# EAGLE design NerfPWM V1.1 (EAGLE 6.3)
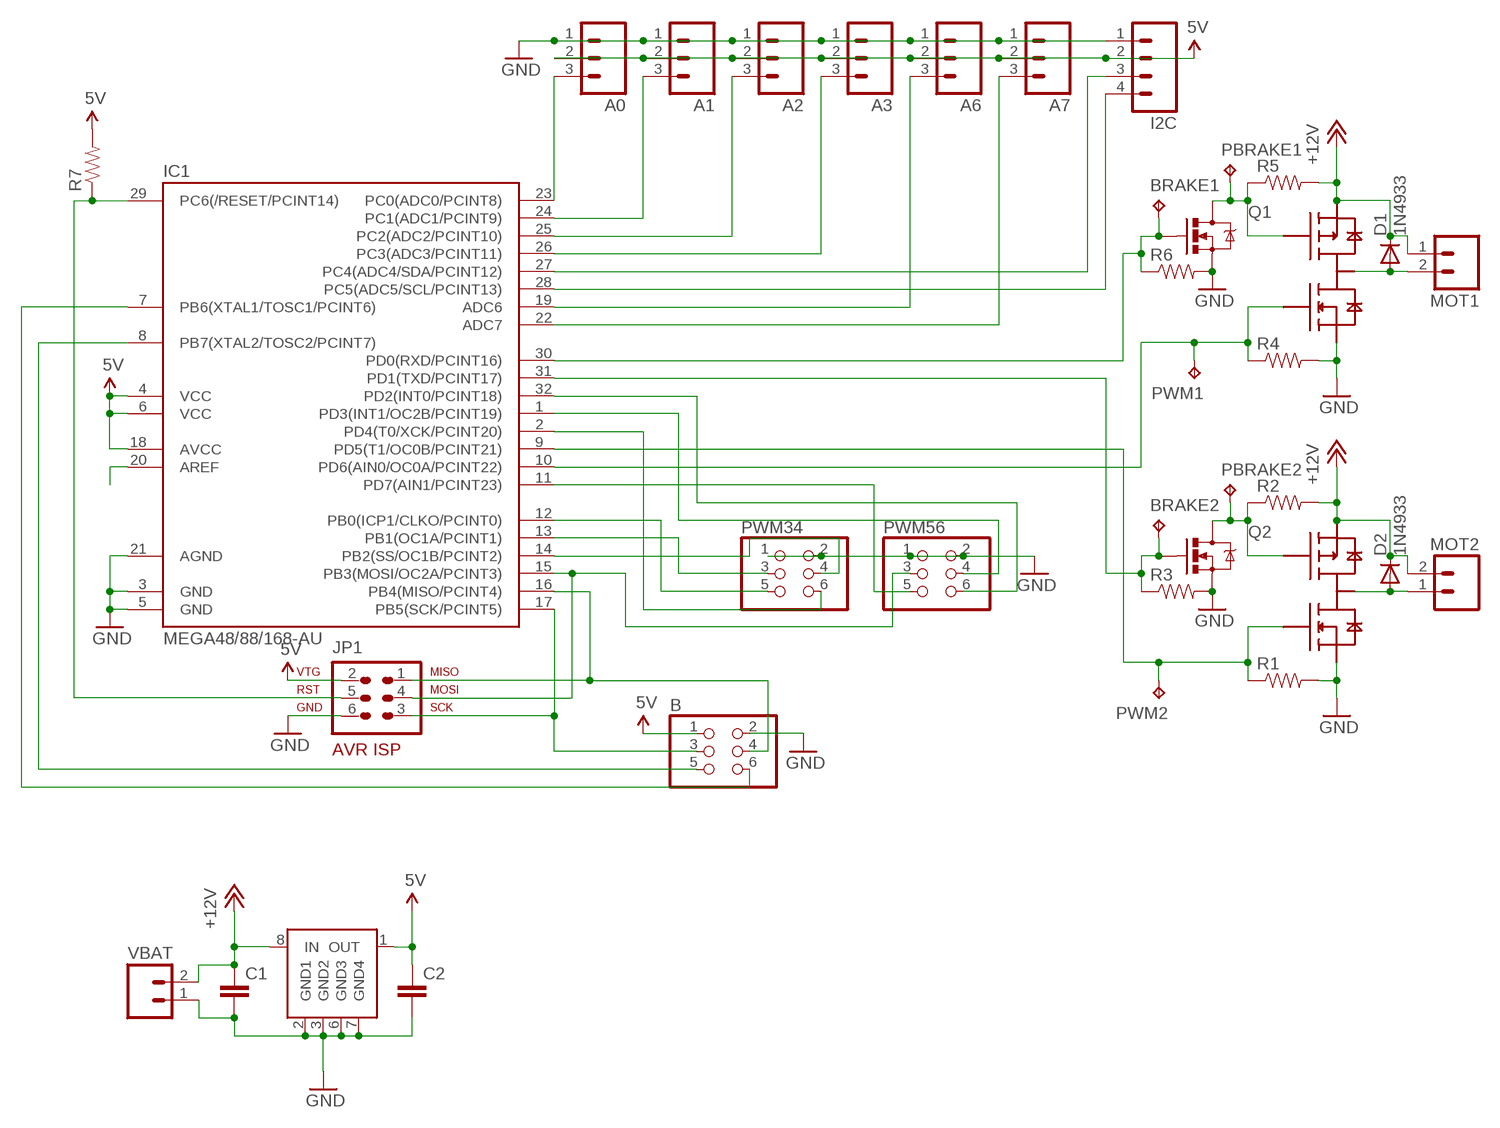
[diagram p0: schematic, sheet 1]

## Parts
A0  M03PTH  [1X03]
A1  M03PTH  [1X03]
A2  M03PTH  [1X03]
A3  M03PTH  [1X03]
A6  M03PTH  [1X03]
A7  M03PTH  [1X03]
B  PINHD-2X3  [2X03]
BRAKE1  TPTP10R  [TP10R]
BRAKE2  TPTP10R  [TP10R]
C1  CAP1206  [1206]
C2  CAP1206  [1206]
D1  1N4933  [DO41-10]
D2  1N4933  [DO41-10]
I2C  M04PTH  [1X04]
IC1  MEGA48/88/168-AU  [TQFP32-08]
JP1  AVR-ISP-6  [AVR-ISP-6]
MOT1  M023.5MM_LOCK  [SCREWTERMINAL-3.5MM-2_LOCK]
MOT2  M023.5MM_LOCK  [SCREWTERMINAL-3.5MM-2_LOCK]
PBRAKE1  TPTP10R  [TP10R]
PBRAKE2  TPTP10R  [TP10R]
PWM1  TPTP10R  [TP10R]
PWM2  TPTP10R  [TP10R]
PWM34  PINHD-2X3  [2X03]
PWM56  PINHD-2X3  [2X03]
Q1  MOSFET-NCHANNELSMD  [SOT23-3]
Q2  MOSFET-NCHANNELSMD  [SOT23-3]
R1  RESISTOR  [0805]
R2  RESISTOR  [0805]
R3  RESISTOR  [0805]
R4  RESISTOR  [0805]
R5  RESISTOR  [0805]
R6  RESISTOR  [0805]
R7  RESISTOR  [0805]
U$3  MC78L00AD  [SOIC8]
U$4  SI4501BDY  [SOIC8]
U$5  SI4501BDY  [SOIC8]
VBAT  M023.5MM_LOCK  [SCREWTERMINAL-3.5MM-2_LOCK]

## Nets
5V [5V]: A0.2 A1.2 A2.2 A3.2 A6.2 A7.2 B.1 C2.1 I2C.2 IC1.4(VCC) IC1.6(VCC) IC1.18(AVCC) JP1.2 R7.2 U$3.1(OUT)
+12V [12V]: C1.1 D1.C D2.C MOT1.1 MOT2.2 R2.2 R5.2 U$3.8(IN) U$4.3(S2) U$5.3(S2) VBAT.2
A1: A1.3 IC1.24(PC1(ADC1/PCINT9))
A2: A2.3 IC1.25(PC2(ADC2/PCINT10))
A3: A3.3 IC1.26(PC3(ADC3/PCINT11))
A6: A6.3 IC1.19(ADC6)
A7: A7.3 IC1.22(ADC7)
A): A0.3 IC1.23(PC0(ADC0/PCINT8))
B4: B.4 IC1.16(PB4(MISO/PCINT4)) JP1.1
B5: B.3 IC1.17(PB5(SCK/PCINT5)) JP1.3
B6: B.6 IC1.7(PB6(XTAL1/TOSC1/PCINT6))
B7: B.5 IC1.8(PB7(XTAL2/TOSC2/PCINT7))
BRAKE1: BRAKE1.TP IC1.30(PD0(RXD/PCINT16)) Q1.1(G) R6.1
BRAKE2: BRAKE2.TP IC1.31(PD1(TXD/PCINT17)) Q2.1(G) R3.1
BRAKE3: IC1.12(PB0(ICP1/CLKO/PCINT0)) PWM34.5
BRAKE4: IC1.2(PD4(T0/XCK/PCINT20)) PWM34.6
BRAKE5: IC1.11(PD7(AIN1/PCINT23)) PWM56.5
BRAKE6: IC1.32(PD2(INT0/PCINT18)) PWM56.6
GND [GND]: A0.1 A1.1 A2.1 A3.1 A6.1 A7.1 B.2 C1.2 C2.2 I2C.1 IC1.3(GND) IC1.5(GND) IC1.21(AGND) JP1.6 PWM34.1 PWM34.2 PWM56.1 PWM56.2 Q1.2(S) Q2.2(S) R1.2 R3.2 R4.2 R6.2 U$3.2(GND1) U$3.3(GND2) U$3.6(GND3) U$3.7(GND4) U$4.1(S1) U$5.1(S1) VBAT.1
N$1: IC1.20(AREF)
N$2: PBRAKE2.TP Q2.3(D) R2.1 U$5.4(G2)
N$3: PBRAKE1.TP Q1.3(D) R5.1 U$4.4(G2)
PWM1: IC1.10(PD6(AIN0/OC0A/PCINT22)) PWM1.TP R4.1 U$4.2(G1)
PWM2: IC1.9(PD5(T1/OC0B/PCINT21)) PWM2.TP R1.1 U$5.2(G1)
PWM3: IC1.13(PB1(OC1A/PCINT1)) PWM34.3
PWM4: IC1.14(PB2(SS/OC1B/PCINT2)) PWM34.4
PWM5: IC1.15(PB3(MOSI/OC2A/PCINT3)) JP1.4 PWM56.3
PWM6: IC1.1(PD3(INT1/OC2B/PCINT19)) PWM56.4
RESET: IC1.29(PC6(/RESET/PCINT14)) JP1.5 R7.1
SCL: I2C.4 IC1.28(PC5(ADC5/SCL/PCINT13))
SDA: I2C.3 IC1.27(PC4(ADC4/SDA/PCINT12))
VMOT1 [MOTOR]: D1.A MOT1.2 U$4.5(D) U$4.6(D) U$4.7(D) U$4.8(D)
VMOT2 [MOTOR]: D2.A MOT2.1 U$5.5(D) U$5.6(D) U$5.7(D) U$5.8(D)

## Library data of the parts
A0 A1-A3 A6 A7 = SparkFun:M03: Header 3 Standard 3-pin 0.1" header. Use with straight break away headers (SKU : PRT-00116), right angle break away headers (PRT-00553), swiss pins (PRT-00743), machine pins (PRT-00117), and female headers (PRT-00115). Molex polarized connector foot print use with SKU : PRT-08232 with associated crimp pins and housings.
B PWM34 PWM56 = pinhead:PINHD-2X3: PIN HEADER
BRAKE1 BRAKE2 PBRAKE1 PBRAKE2 PWM1 PWM2 = testpad:TP: Test pad
C1 C2 = SparkFun:CAP: Capacitor Standard 0603 ceramic capacitor, and 0.1" leaded capacitor.
D1 D2 = diode:1N4933: DIODE fast recovery rectifier, 1A
I2C = SparkFun:M04: Header 4 Standard 4-pin 0.1" header. Use with straight break away headers (SKU : PRT-00116), right angle break away headers (PRT-00553), swiss pins (PRT-00743), machine pins (PRT-00117), and female headers (PRT-00115). Molex polarized connector foot print use with SKU : PRT-08231 with associated crimp pins and housings.
IC1 = avr-4:MEGA48/88/168
JP1 = custom:AVR-ISP-6: AVR ISP-6 Serial Programming Header
MOT1 MOT2 VBAT = SparkFun:M02: Header 2 Standard 2-pin 0.1" header. Use with straight break away headers (SKU : PRT-00116), right angle break away headers (PRT-00553), swiss pins (PRT-00743), machine pins (PRT-00117), and female headers (PRT-00115). Molex polarized connector foot print use with SKU : PRT-08233 with associated crimp pins and housings.
Q1 Q2 = SparkFun:MOSFET-NCHANNEL
R1-R7 = SparkFun:RESISTOR: Resistor Basic schematic elements and footprints for 0603, 1206, and PTH 1/10th watt (small) resistors.
U$3 = custom:MC78L00A
U$4 U$5 = custom:SI4501BDY

## Net classes
0 default: width 0.152 mm, drill 0.33 mm, clearance 0.152 mm
1 12V: width 0.61 mm, drill 0.508 mm, clearance 0.305 mm to class 0, clearance 0.305 mm
2 5V: width 0.305 mm, drill 0.33 mm, clearance 0.152 mm to class 0, clearance 0.305 mm to class 1, clearance 0.305 mm
3 MOTOR: width 0.61 mm, drill 0.508 mm, clearance 0.305 mm to class 0, clearance 0.61 mm to class 1, clearance 0.305 mm to class 2, clearance 0.152 mm
4 GND: width 0.305 mm, drill 0.33 mm, clearance 0.152 mm to class 0, clearance 0.61 mm to class 1, clearance 0.152 mm to class 2, clearance 0.61 mm to class 3, clearance 0.152 mm

## Board
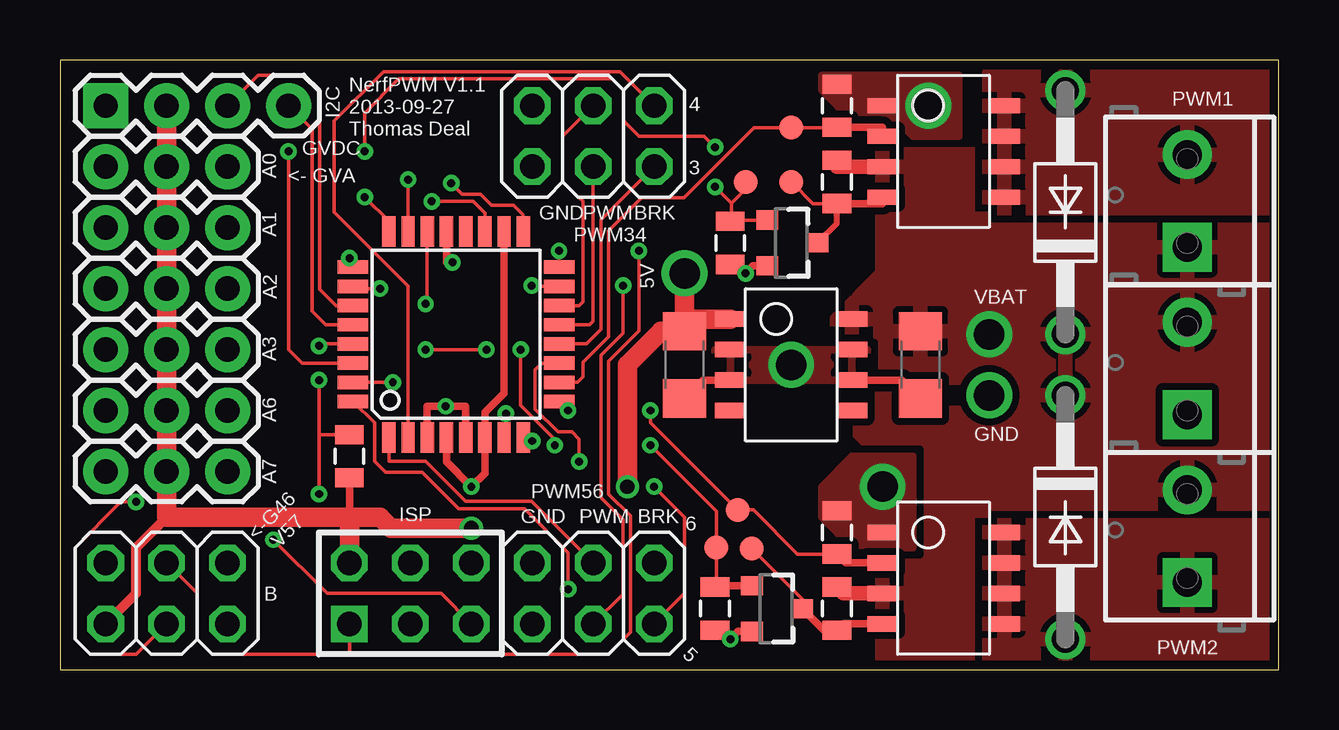
[diagram p1: board, top side]
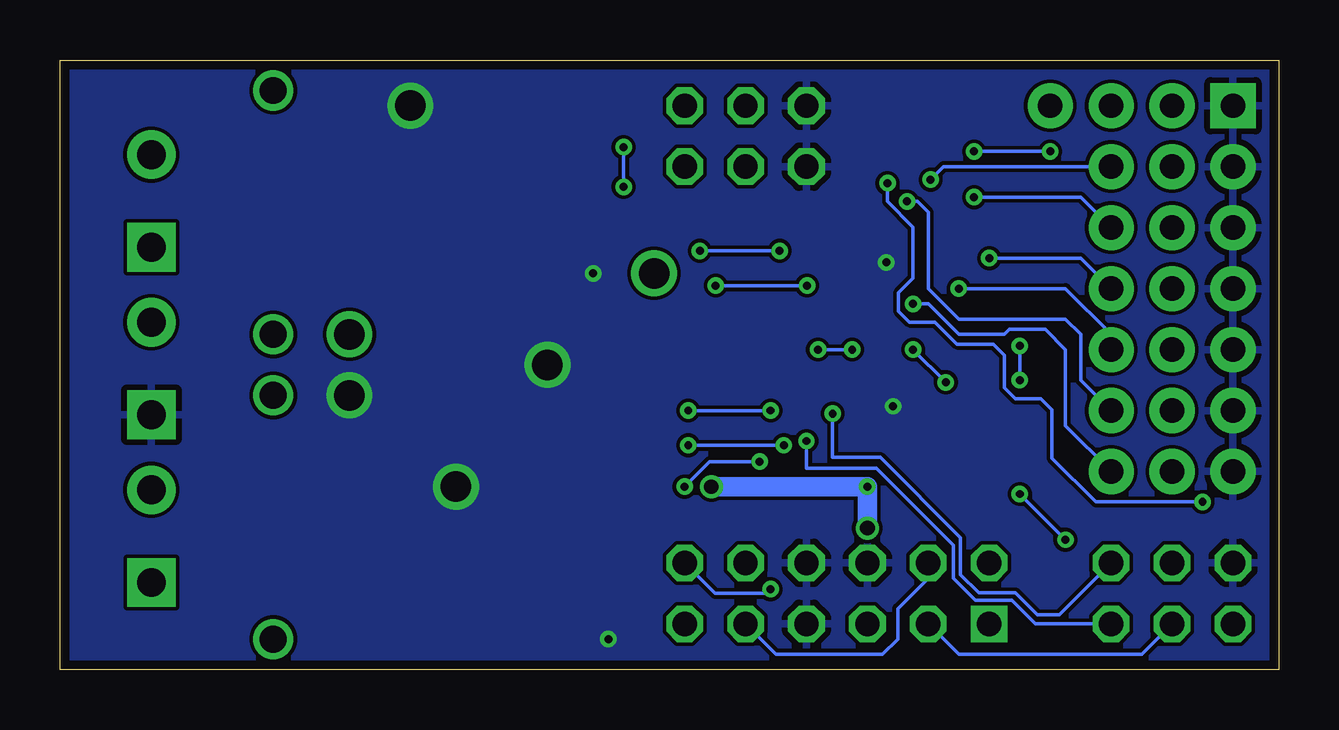
[diagram p2: board, bottom side, seen from below]

Size 50.8 x 25.4 mm. Coordinates in mm from the lower left corner, seen from the top.
Outline: 0,0 50.8,0 50.8,25.4 0,25.4 0,0
Copper layers (1*16): Top 0.0356mm / dielectric 1.5011mm / Bottom 0.0356mm
Design rules "LaenPCBOrder *": minimum track width 6mil, minimum drill 13mil, track to track 6mil, track to pad 6mil, pad to pad 6mil, via to via 6mil, smd to smd 6mil, copper to edge 15mil, drill to drill 6mil, minimum pad ring 7mil, minimum via ring 7mil, stop-mask expansion 4mil, vias tented up to drill 24mil, thermal gap 10mil

### Footprints (pad centres in the part's own frame; a part is rotated, then mirrored left to right if it is on the bottom)
1X03 = drill 1.016 pad 1.88: 1 0,0; 2 2.54,0; 3 5.08,0
2X03 = drill 1.016 octagon: 1 -2.54,-1.27; 2 -2.54,1.27; 3 0,-1.27; 4 0,1.27; 5 2.54,-1.27; 6 2.54,1.27
TP10R = smd 1 x 1: TP 0,0
1206 = smd 1.6 x 1.8: 1 -1.4,0; 2 1.4,0
DO41-10 = drill 1.118: A 5.08,0; C -5.08,0
1X04 = drill 1.016 pad 1.88 square: 1 0,0 | drill 1.016 pad 1.88: 2 2.54,0; 3 5.08,0; 4 7.62,0
TQFP32-08 = smd 1.27 x 0.559: 1 -4.293,2.8; 2 -4.293,2; 3 -4.293,1.2; 4 -4.293,0.4; 5 -4.293,-0.4; 6 -4.293,-1.2; 7 -4.293,-2; 8 -4.293,-2.8; 17 4.293,-2.8; 18 4.293,-2; 19 4.293,-1.2; 20 4.293,-0.4; 21 4.293,0.4; 22 4.293,1.2; 23 4.293,2; 24 4.293,2.8 | smd 0.559 x 1.27: 9 -2.8,-4.293; 10 -2,-4.293; 11 -1.2,-4.293; 12 -0.4,-4.293; 13 0.4,-4.293; 14 1.2,-4.293; 15 2,-4.293; 16 2.8,-4.293; 25 2.8,4.293; 26 2,4.293; 27 1.2,4.293; 28 0.4,4.293; 29 -0.4,4.293; 30 -1.2,4.293; 31 -2,4.293; 32 -2.8,4.293
AVR-ISP-6 = drill 1.016 square: 1 -2.54,-1.27 | drill 1.016 octagon: 2 -2.54,1.27; 3 0,-1.27; 4 0,1.27; 5 2.54,-1.27; 6 2.54,1.27
SCREWTERMINAL-3.5MM-2_LOCK = drill 1.2 pad 2.032 square: 1 -0.178,0 | drill 1.2 pad 2.032: 2 3.678,0
SOT23-3 = smd 0.8 x 0.9: 1 -0.95,-1; 2 0.95,-1; 3 0,1.1
0805 = smd 0.8 x 1.2: 1 -0.9,0; 2 0.9,0
SOIC8 = smd 0.635 x 1.27: 1 -1.905,-2.54; 2 -0.635,-2.54; 3 0.635,-2.54; 4 1.905,-2.54; 5 1.905,2.54; 6 0.635,2.54; 7 -0.635,2.54; 8 -1.905,2.54

### Placement (x,y rotation side)
A0  1.91,20.95 0 top
A1  1.91,18.41 0 top
A2  1.91,15.88 0 top
A3  1.91,13.34 0 top
A6  1.91,10.79 0 top
A7  1.91,8.26 0 top
B  4.45,3.17 0 top
BRAKE1  28.57,20.32 0 top
BRAKE2  27.36,5.08 0 top
C1  35.86,12.7 270 top
C2  26.04,12.7 270 top
D1  41.91,19.05 90 top
D2  41.91,6.35 270 top
I2C  1.91,23.5 0 top
IC1  16.51,13.97 90 top
JP1  14.61,3.17 0 top
MOT1  46.99,17.78 90 top
MOT2  46.99,3.81 90 top
PBRAKE1  30.48,20.32 0 top
PBRAKE2  28.83,5.05 0 top
PWM1  30.48,22.58 0 top
PWM2  28.24,6.65 0 top
PWM34  22.23,22.23 0 top
PWM56  22.23,3.17 0 top
Q1  30.48,17.78 270 top
Q2  29.84,2.54 270 top
R1  32.38,5.71 90 top
R2  32.38,2.54 90 top
R3  27.3,2.54 270 top
R4  32.38,23.5 90 top
R5  32.38,20.32 90 top
R6  27.94,17.78 270 top
R7  12.06,8.89 270 top
U$3  30.48,12.7 270 top
U$4  36.83,21.59 270 top
U$5  36.83,3.81 270 top
VBAT  46.99,10.79 90 top

### Tracks (layer width: path | path; a pad name or v marks a point on that pad's centre or on a via)
5V  (via drill 0.33, 0.6, 0.61, 1.27)
  Top 0.305: IC1.18 18.51,11.53 17.71,10.72 IC1.6 17.71,8.19 v17.14,7.62 16.11,8.65 IC1.4 | R7.2 12.06,6.35
  Top 0.406: B.1 3.17,3.17 3.17,5.08 4.45,6.35
  Top 0.813: I2C.2 A0.2 A1.2 A2.2 A3.2 A6.2 A7.2 4.45,6.35 12.06,6.35 | 12.06,6.35 13.34,6.35 13.79,5.89 v17.14,5.89 | v23.65,7.62 23.65,12.7 25.05,14.1 C2.1 | C2.1 26.54,14.61 U$3.1 | v26.04,16.51 C2.1 | 12.06,6.35 JP1.2
  Bottom 0.813: v17.14,5.89 v17.14,7.62 v23.65,7.62
+12V  (via drill 1.27)
  Top 0.61: U$4.3 32.38,20.95 R5.2 | U$5.3 32.65,3.17 R2.2
  other vias: 38.73,13.97
  pour Top (rank 2): 34.29,25.4 50.8,25.4 50.8,0 34.29,0 34.29,8.89 32.38,10.79 32.38,14.61 34.29,16.51
A1  (via drill 0.33)
  Top 0.152: v12.7,19.68 13.71,18.68 IC1.24
  Bottom 0.152: A1.3 8.26,19.68 v12.7,19.68
A2  (via drill 0.33)
  Top 0.152: v12.06,17.14 12.22,16.99 IC1.25
  Bottom 0.152: A2.3 8.26,17.14 v12.06,17.14
A3  (via drill 0.33)
  Top 0.152: IC1.26 12.31,15.88 v13.34,15.88
  Bottom 0.152: v13.34,15.88 8.89,15.88 6.99,13.97 A3.3
A6  (via drill 0.33)
  Top 0.152: v15.49,19.51 17.22,19.51 17.71,19.02 IC1.19
  Bottom 0.152: A6.3 8.26,12.06 8.26,13.97 8.89,14.61 13.34,14.61 14.61,15.88 14.61,19.05 15.06,19.51 v15.49,19.51
A7  (via drill 0.33)
  Top 0.152: v15.24,15.24 15.31,15.31 IC1.22
  Bottom 0.152: A7.3 8.89,10.16 8.89,13.34 9.73,14.17 11.23,14.17 11.43,13.97 13.34,13.97 14.61,15.24 v15.24,15.24
A)  (via drill 0.33)
  Top 0.152: v14.51,20.41 IC1.23
  Bottom 0.152: A0.3 13.97,20.95 v14.51,20.41
B4  (via drill 0.33)
  Top 0.152: B.4 5.71,3.17 5.71,1.27 6.35,0.64 12.06,0.64 | 12.06,0.64 22.86,0.64 23.77,1.55 23.77,6.4 22.86,7.32 22.86,12.85 24.13,14.12 v24.13,17.45 | v20.8,17.45 IC1.16 | JP1.1 12.06,0.64
  Bottom 0.152: v24.13,17.45 v20.8,17.45
B5  (via drill 0.33)
  Top 0.152: IC1.17 19.31,18.94 18.9,19.36 17.98,19.36 17.53,19.81 16.76,19.81 v16.31,20.27 | v3.17,6.99 2.54,6.99 0.64,5.08 0.64,1.27 1.27,0.64 3.17,0.64 B.3
  Bottom 0.152: B.3 5.71,0.64 13.34,0.64 JP1.3 | v16.31,20.27 16.31,19.51 15.24,18.44 15.24,16.31 15.85,15.7 15.85,14.94 15.39,14.48 14.33,14.48 13.41,13.56 11.89,13.56 11.43,13.11 11.43,11.73 10.97,11.28 9.91,11.28 9.45,10.82 9.45,8.81 7.62,6.99 v3.17,6.99
B6  (via drill 0.33)
  Top 0.152: IC1.7 18.59,9.76 v18.59,10.67
  Bottom 0.152: v18.59,10.67 18.59,8.84 16.61,8.84 13.26,5.49 13.26,3.96 12.5,3.2 10.97,3.2 10.06,2.29 9.14,2.29 B.6
B7  (via drill 0.33)
  Top 0.152: IC1.8 19.31,9.53 v19.68,9.53
  Bottom 0.152: v19.68,9.53 19.68,8.38 16.76,8.38 13.56,5.18 13.56,3.81 12.65,2.9 11.12,2.9 10.13,1.91 B.5
BRAKE1  (via drill 0.33)
  Top 0.152: v9.53,21.59 9.53,13.34 10.09,12.77 IC1.30 | v12.7,21.59 12.7,23.19 14.12,24.61 23.01,24.61 23.5,24.13 23.5,22.86 24.13,22.23 26.85,22.23 v27.3,21.77 | Q1.1 27.99,18.73 | 27.99,18.73 R6.1 | 27.99,18.73 27.99,19.43 | 27.99,19.43 v27.3,20.12 | 27.99,19.43 28.57,20.02 BRAKE1.TP
  Bottom 0.152: v12.7,21.59 v9.53,21.59 | v27.3,21.77 v27.3,20.12
BRAKE2  (via drill 0.33)
  Top 0.152: 27.36,3.49 BRAKE2.TP 27.36,6.6 v24.61,9.35 | v19.2,13.34 19.2,11.02 20.62,9.6 v20.62,9.35 | v17.78,13.34 v15.24,13.34 | v13.88,11.97 IC1.31
  Top 0.305: Q2.1 27.36,3.49 R3.1
  Bottom 0.152: v24.61,9.35 v20.62,9.35 | v19.2,13.34 v17.78,13.34 | v15.24,13.34 v13.88,11.97
BRAKE3
  Top 0.152: IC1.12 21.95,13.57 22.55,14.17 22.55,18.75 PWM34.5
BRAKE4
  Top 0.152: PWM34.6 23.34,24.92 13.49,24.92 11.43,22.86 11.43,19.05 14.51,15.97 IC1.2
BRAKE5  (via drill 0.33)
  Top 0.152: 20.77,12.8 IC1.11 20.09,12.77 19.81,12.5 19.81,10.85 20.75,9.91 21.34,9.91 21.64,9.6 v21.64,8.66 | v24.77,7.62 26.04,6.35 26.04,3.17 PWM56.5
  Bottom 0.152: v21.64,8.66 23.72,8.66 v24.77,7.62
BRAKE6  (via drill 0.33)
  Top 0.152: v21.18,3.35 21.18,4.88 19.36,6.71 16.61,6.71 15.09,8.23 13.56,8.23 13.11,8.69 13.11,10.28 IC1.32
  Bottom 0.152: PWM56.6 23.5,3.17 21.36,3.17 v21.18,3.35
GND  (via drill 0.33, 1.27)
  Top 0.305: IC1.3 15.31,10.97 v16.08,10.97 16.91,10.97 IC1.5 | IC1.21 16.11,16.97 v16.36,16.97 | Q1.2 28.89,16.83 v28.57,16.51 28.2,16.88 R6.2 | U$3.6 35.1,12.06 C1.2 | U$3.3 26.8,12.06 C2.2 | Q2.2 28.26,1.59 v27.94,1.27 27.57,1.64 R3.2
  other vias: 30.48,12.7 36.2,23.5 34.29,7.62 38.73,11.43
  pour Bottom: 0,25.4 50.8,25.4 50.8,0 0,0
  pour Top: 27.3,13.34 33.66,13.34 33.66,12.06 27.3,12.06
  pour Top (isolate 0.305, no thermals): 35.56,5.08 33.02,5.08 31.75,6.35 31.75,7.62 33.02,8.89 35.56,8.89
  pour Top (isolate 0.305, no thermals): 31.75,24.13 31.75,24.77 37.47,24.77 37.47,22.23 35.56,22.23 34.92,22.86 33.02,22.86
N$2
  Top 0.152: PBRAKE2.TP 30.95,2.94 Q2.3
  Top 0.305: U$5.4 32.65,1.91 R2.1 31.84,1.64 Q2.3
N$3
  Top 0.152: R5.1 31.38,19.42 PBRAKE1.TP
  Top 0.254: Q1.3 32.38,18.59 R5.1
  Top 0.305: U$4.4 34.29,19.42 R5.1
PWM1
  Top 0.152: IC1.10 21.57,11.97 21.79,12.19 21.79,12.8 22.86,13.87 22.86,18.29 24.23,19.66 26.01,19.66 28.93,22.58 PWM1.TP 32.37,22.58 R4.1
  Top 0.305: U$4.2 34.29,22.59 R4.1
PWM2  (via drill 0.33)
  Top 0.152: v21.18,10.79 IC1.9 | R1.1 30.75,4.82 28.91,6.66 PWM2.TP 24.61,10.29 v24.61,10.79
  Top 0.305: U$5.2 32.76,4.45 R1.1
  Bottom 0.152: v24.61,10.79 v21.18,10.79
PWM3
  Top 0.152: PWM34.3 22.23,14.52 22.07,14.37 IC1.13
PWM4
  Top 0.152: PWM34.4 20.95,22.23 20.95,20.32 21.59,19.68 21.61,19.68 21.79,19.51 21.79,15.32 21.64,15.17 IC1.14
PWM5  (via drill 0.33)
  Top 0.152: v23.47,16 23.47,14.02 22.55,13.11 22.55,7.16 23.47,6.25 23.47,3.15 PWM56.3 | v19.66,16 19.69,15.97 IC1.15
  Bottom 0.152: PWM56.3 20.95,0.64 16.51,0.64 15.88,1.27 15.88,2.54 14.61,3.81 JP1.4 | v23.47,16 v19.66,16
PWM6
  Top 0.152: PWM56.4 19.66,7.01 16.92,7.01 15.24,8.69 13.71,8.69 IC1.1
RESET  (via drill 0.33)
  Top 0.152: v10.79,13.49 10.88,13.57 IC1.29 | v10.79,12.06 10.79,9.79 | 10.79,9.79 R7.1 | v10.79,7.32 10.79,9.79 | JP1.5 15.88,3.17 11.12,3.17 v8.89,5.41
  Bottom 0.152: v10.79,12.06 v10.79,13.49 | v8.89,5.41 v10.79,7.32
SCL
  Top 0.152: I2C.4 10.52,22.5 10.52,14.94 11.08,14.37 IC1.28
SDA
  Top 0.152: I2C.3 8.26,24.77 10.16,24.77 10.82,24.11 10.82,15.85 11.5,15.17 IC1.27
VMOT1
  pour Top: 38.73,19.23 38.73,24.89 50.8,24.89 50.8,19.23
VMOT2
  pour Top: 38.73,6.02 38.73,0 50.8,0 50.8,6.02

### Text on the board
tPlace: 4 | PWM1 | NerfPWM V1.1 / 2013-09-27 / Thomas Deal | GVDC | 3 | <- GVA | GND | PWM | BRK | 5V | VBAT | GND | ISP | GND | PWM | BRK | 6 | <-G46 / V57 | 5 | PWM2